# EAGLE schematic PS-001 (EAGLE 9.6.0)

## Sheet 1 of 4
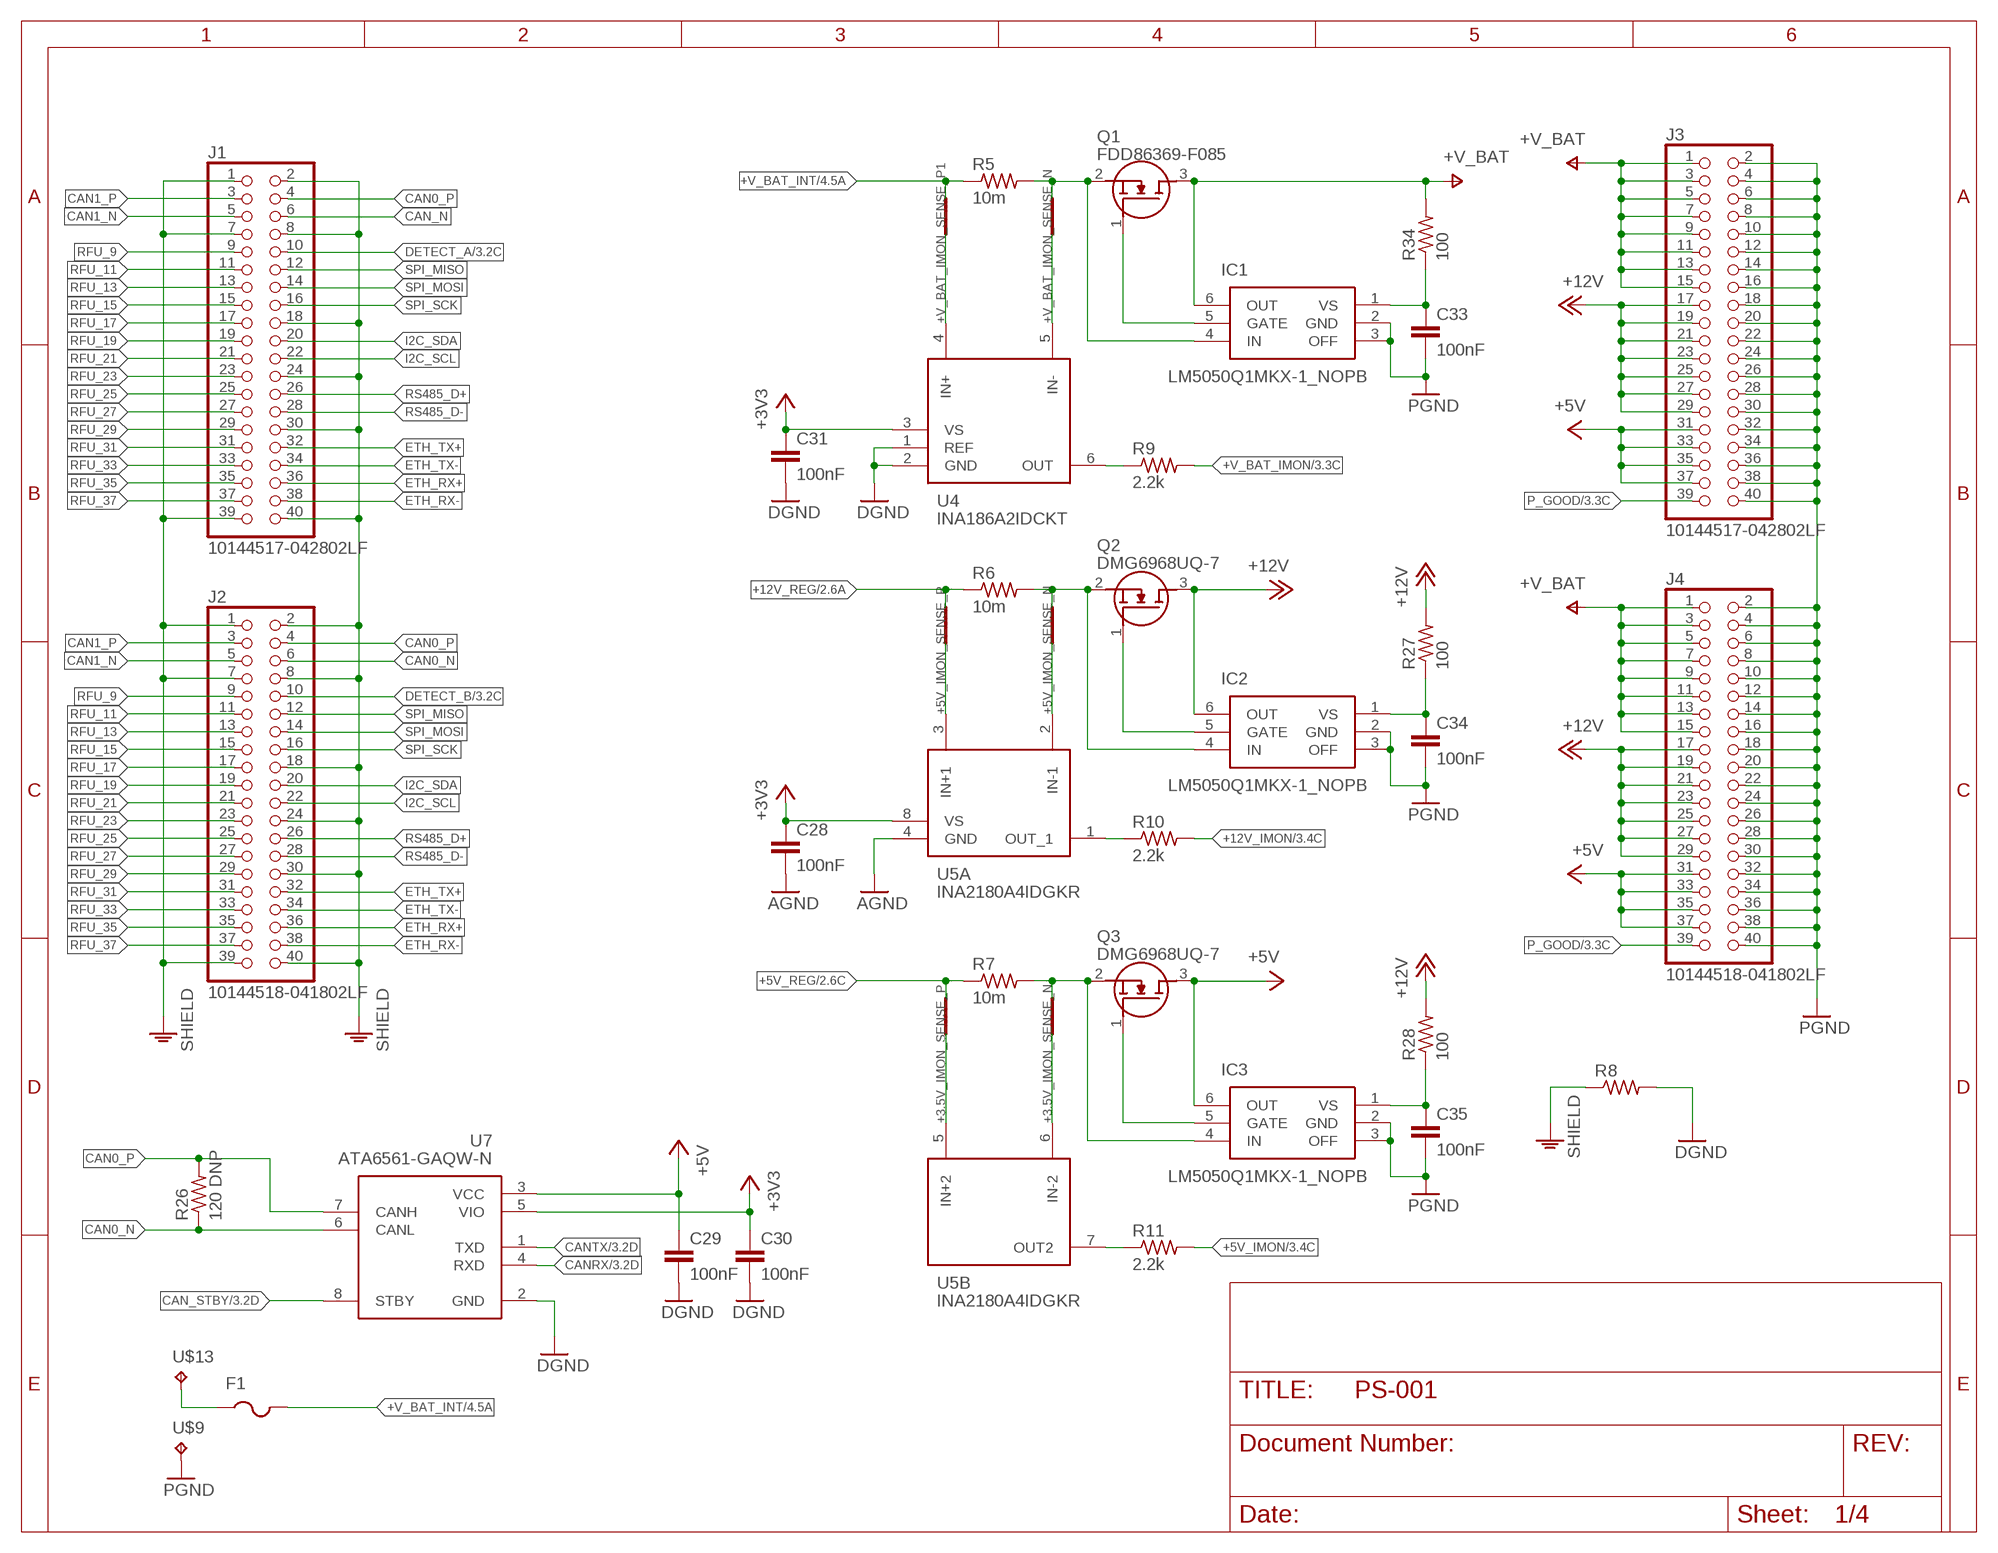
[diagram p0: schematic, sheet 1]

### Parts
C28  100nF  C-EUC0402  [C0402]
C29  100nF  C-EUC0402  [C0402]
C30  100nF  C-EUC0402  [C0402]
C31  100nF  C-EUC0402  [C0402]
C33  100nF  C-EUC0402  [C0402]
C34  100nF  C-EUC0402  [C0402]
C35  100nF  C-EUC0402  [C0402]
F1  PTCFUSE-1206  [R1206]
IC1  LM5050Q1MKX-1_NOPB  [SOT95P280X110-6N]
IC2  LM5050Q1MKX-1_NOPB  [SOT95P280X110-6N]
IC3  LM5050Q1MKX-1_NOPB  [SOT95P280X110-6N]
J1  10144517-042802LF  [10144517-042802LF]
J2  10144518-041802LF  [10144518-041802LF]
J3  10144517-042802LF  [10144517-042802LF]
J4  10144518-041802LF  [10144518-041802LF]
Q1  FDD86369-F085  [DPAK3-CASE-369AS]
Q2  DMG6968UQ-7  [SOT96P240X100-3N]
Q3  DMG6968UQ-7  [SOT96P240X100-3N]
R5  10m  R-US_R0603  [R0603]
R6  10m  R-US_R0603  [R0603]
R7  10m  R-US_R0603  [R0603]
R8  R-US_R0402  [R0402]
R9  2.2k  R-US_R0402  [R0402]
R10  2.2k  R-US_R0402  [R0402]
R11  2.2k  R-US_R0402  [R0402]
R26  120 DNP  R-US_R0402  [R0402]
R27  100  R-US_R0402  [R0402]
R28  100  R-US_R0402  [R0402]
R34  100  R-US_R0402  [R0402]
SH1  SHORTT8  [SHORT_TOP-8]
SH2  SHORTT8  [SHORT_TOP-8]
SH3  SHORTT8  [SHORT_TOP-8]
SH4  SHORTT8  [SHORT_TOP-8]
SH5  SHORTT8  [SHORT_TOP-8]
SH6  SHORTT8  [SHORT_TOP-8]
U4  INA186A2IDCKT  [SOT65P210X110-6N]
U5  INA2180A4IDGKR  INA2180A2IDGKR  [SOP65P490X110-8N]
U7  ATA6561-GAQW-N  [SOIC127P600X175-8N]
U$9  WIRE-PAD  [12AWG-STRANDED]
U$13  WIRE-PAD  [12AWG-STRANDED]

### Nets
+3.5V_IMON_SENSE_N: SH2.1 U5.6(B:IN-2)
+3.5V_IMON_SENSE_P: SH1.1 U5.5(B:IN+2)
+3V3: C28.1 C30.1 C31.1 U4.3(VS) U5.8(A:VS) U7.5(VIO) ; also sheet 2,3,4
+5V: C29.1 IC3.6(OUT) J3.31 J3.33 J3.35 J3.37 J4.31 J4.33 J4.35 J4.37 Q3.3(D) U7.3(VCC) ; also sheet 2,4
+5V_IMON: R11.2 ; also sheet 3
+5V_IMON_SENSE_N: SH4.1 U5.2(A:IN-1)
+5V_IMON_SENSE_P: SH3.1 U5.3(A:IN+1)
+5V_REG: R7.1 SH1.2 ; also sheet 2,4
+12V: IC2.6(OUT) J3.17 J3.19 J3.21 J3.23 J3.25 J3.27 J3.29 J4.17 J4.19 J4.21 J4.23 J4.25 J4.27 J4.29 Q2.3(D) R27.2 R28.2 ; also sheet 4
+12V_IMON: R10.2 ; also sheet 3
+12V_REG: R6.1 SH3.2 ; also sheet 2,4
+V_BAT: IC1.6(OUT) J3.1 J3.3 J3.5 J3.7 J3.9 J3.11 J3.13 J3.15 J4.1 J4.3 J4.5 J4.7 J4.9 J4.11 J4.13 J4.15 Q1.3(D) R34.2 ; also sheet 2,4
+V_BAT_IMON: R9.2 ; also sheet 3
+V_BAT_IMON_SENSE_N: SH6.1 U4.5(IN-)
+V_BAT_IMON_SENSE_P1: SH5.1 U4.4(IN+)
+V_BAT_INT: F1.2 R5.1 SH5.2 ; also sheet 4
AGND: C28.2 U5.4(A:GND)
CAN0_N: J2.6 R26.1 U7.6(CANL)
CAN0_P: J1.4 J2.4 R26.2 U7.7(CANH)
CAN1_N: J1.5 J2.5
CAN1_P: J1.3 J2.3
CAN_N: J1.6
CAN_STBY: U7.8(STBY) ; also sheet 3
CANRX: U7.4(RXD) ; also sheet 3
CANTX: U7.1(TXD) ; also sheet 3
DETECT_A: J1.10 ; also sheet 3
DETECT_B: J2.10 ; also sheet 3
DGND: C29.2 C30.2 C31.2 R8.2 U4.1(REF) U4.2(GND) U7.2(GND) ; also sheet 2,3,4
ETH_RX+: J1.36 J2.36
ETH_RX-: J1.38 J2.38
ETH_TX+: J1.32 J2.32
ETH_TX-: J1.34 J2.34
I2C_SCL: J1.22 J2.22
I2C_SDA: J1.20 J2.20
N$11: IC2.4(IN) Q2.2(S) R6.2 SH4.2
N$12: IC3.4(IN) Q3.2(S) R7.2 SH2.2
N$13: IC1.5(GATE) Q1.1(G)
N$14: C33.1 IC1.1(VS) R34.1
N$16: F1.1 U$13.P$1(TP)
N$17: R9.1 U4.6(OUT)
N$18: R10.1 U5.1(A:OUT_1)
N$19: IC1.4(IN) Q1.2(S) R5.2 SH6.2
N$20: IC2.5(GATE) Q2.1(G)
N$21: R11.1 U5.7(B:OUT2)
N$22: C34.1 IC2.1(VS) R27.1
N$25: IC3.5(GATE) Q3.1(G)
N$26: C35.1 IC3.1(VS) R28.1
P_GOOD: J3.39 J4.39 ; also sheet 3
PGND: C33.2 C34.2 C35.2 IC1.2(GND) IC1.3(OFF) IC2.2(GND) IC2.3(OFF) IC3.2(GND) IC3.3(OFF) J3.2 J3.4 J3.6 J3.8 J3.10 J3.12 J3.14 J3.16 J3.18 J3.20 J3.22 J3.24 J3.26 J3.28 J3.30 J3.32 J3.34 J3.36 J3.38 J3.40 J4.2 J4.4 J4.6 J4.8 J4.10 J4.12 J4.14 J4.16 J4.18 J4.20 J4.22 J4.24 J4.26 J4.28 J4.30 J4.32 J4.34 J4.36 J4.38 J4.40 U$9.P$1(TP) ; also sheet 2,3
RFU_9: J1.9 J2.9
RFU_11: J1.11 J2.11
RFU_13: J1.13 J2.13
RFU_15: J1.15 J2.15
RFU_17: J1.17 J2.17
RFU_19: J1.19 J2.19
RFU_21: J1.21 J2.21
RFU_23: J1.23 J2.23
RFU_25: J1.25 J2.25
RFU_27: J1.27 J2.27
RFU_29: J1.29 J2.29
RFU_31: J1.31 J2.31
RFU_33: J1.33 J2.33
RFU_35: J1.35 J2.35
RFU_37: J1.37 J2.37
RS485_D+: J1.26 J2.26
RS485_D-: J1.28 J2.28
SHIELD: J1.1 J1.2 J1.7 J1.8 J1.18 J1.24 J1.30 J1.39 J1.40 J2.1 J2.2 J2.7 J2.8 J2.18 J2.24 J2.30 J2.39 J2.40 R8.1
SPI_MISO: J1.12 J2.12
SPI_MOSI: J1.14 J2.14
SPI_SCK: J1.16 J2.16

## Sheet 2 of 4
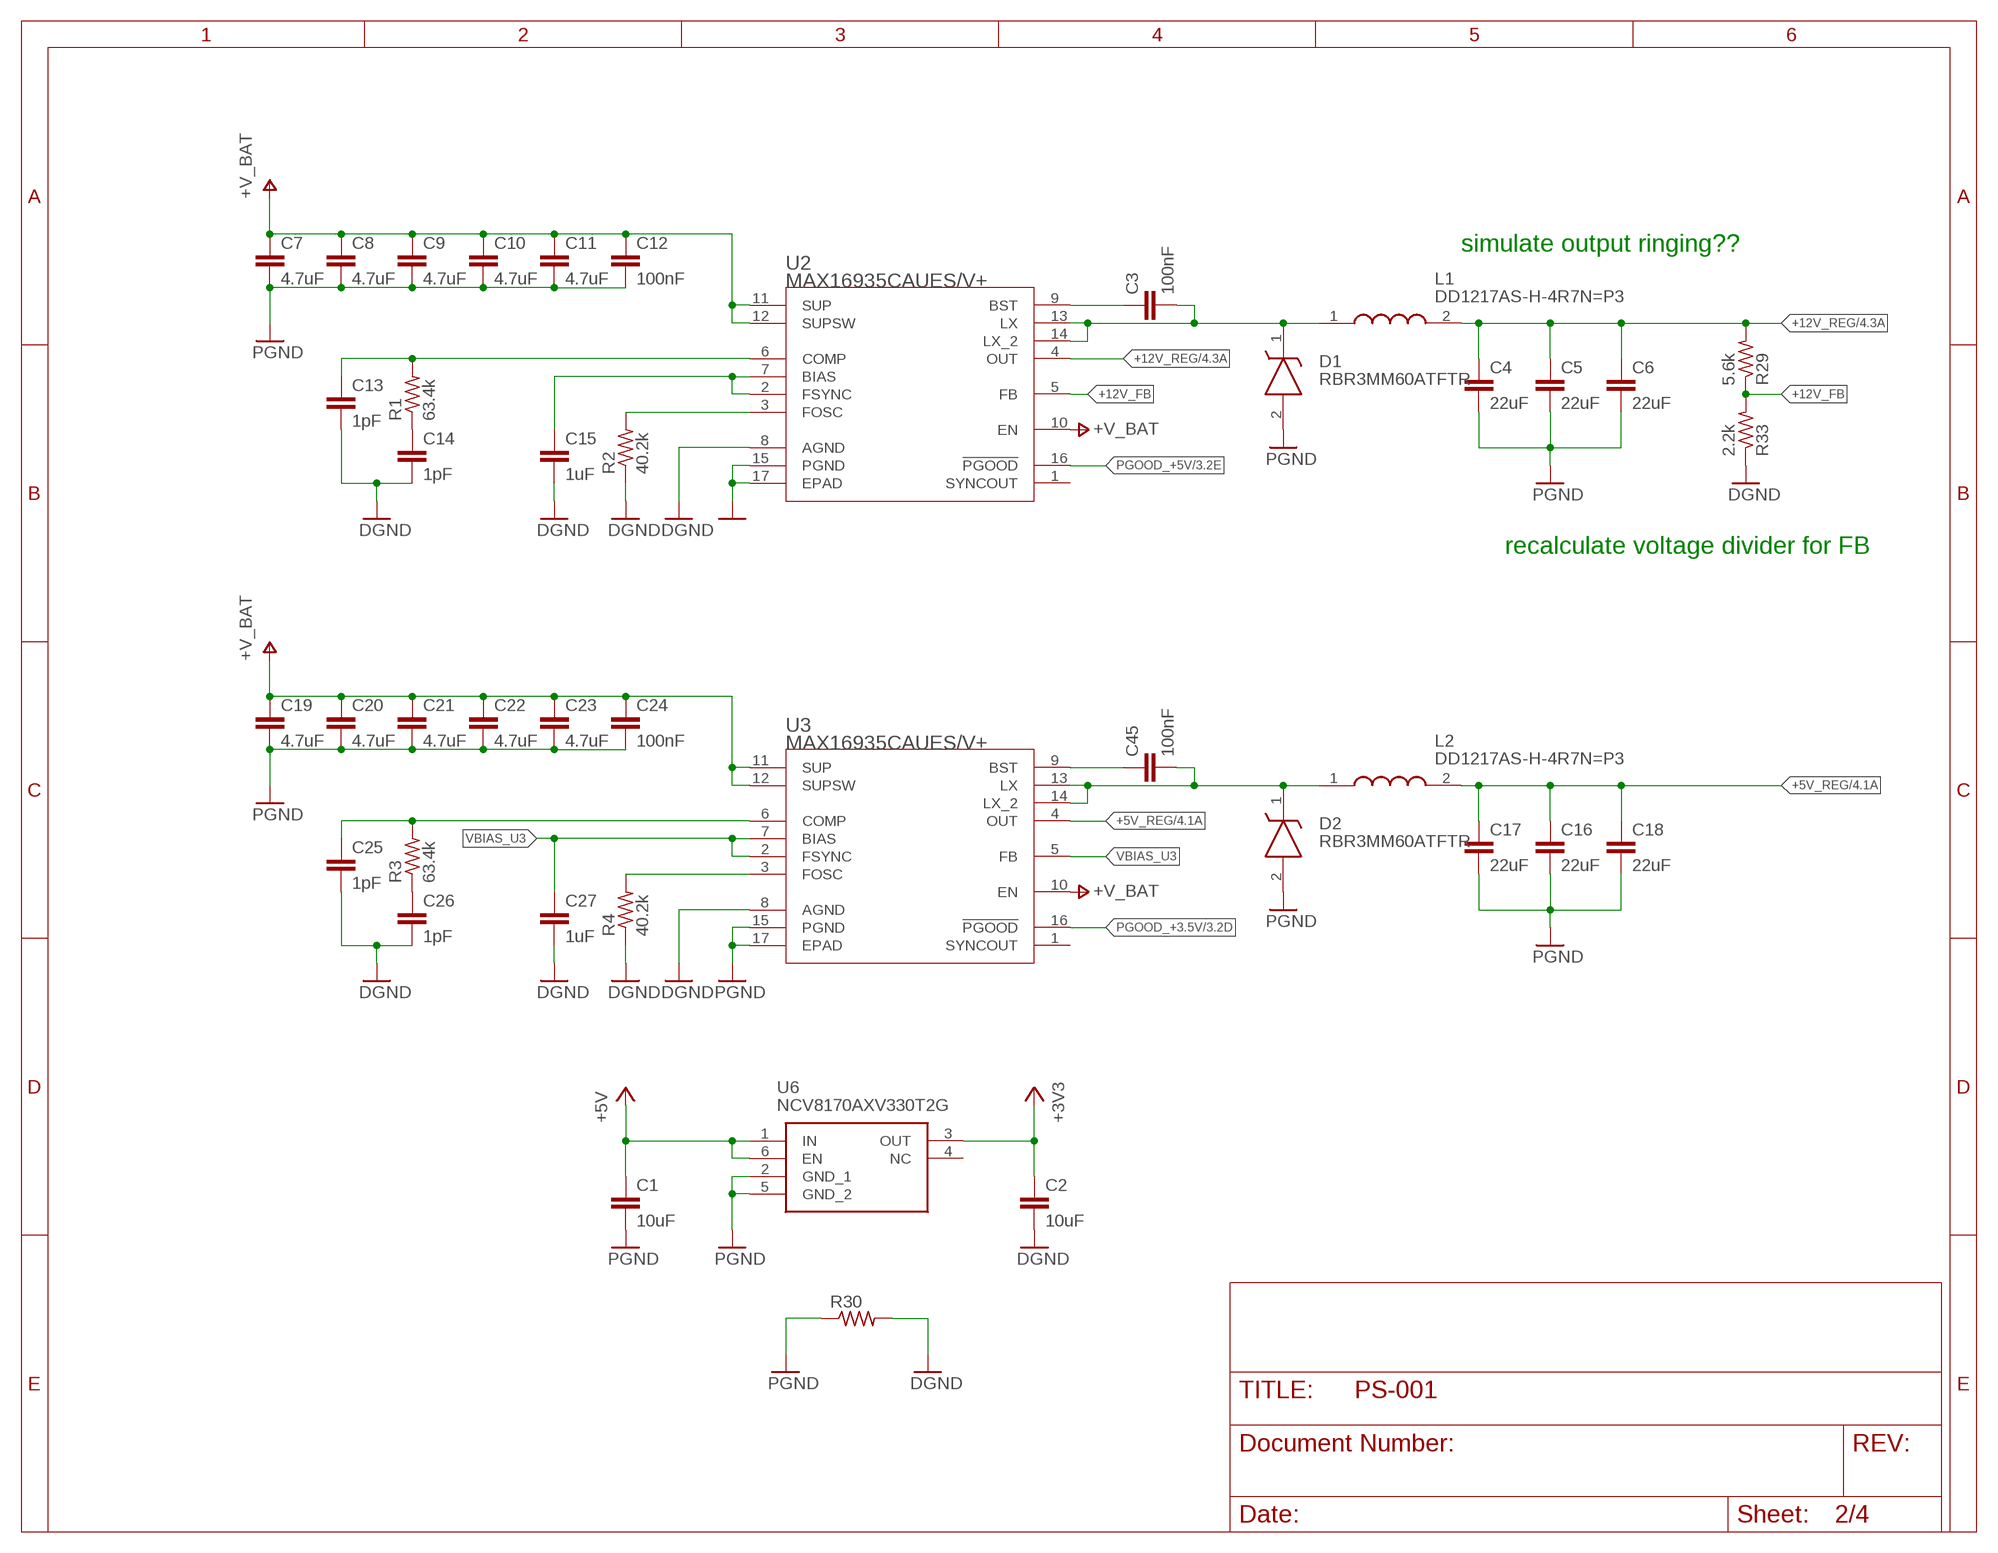
[diagram p1: schematic, sheet 2]

### Parts
C1  10uF  C-EUC0805  [C0805]
C2  10uF  C-EUC0805  [C0805]
C3  100nF  C-EUC0603  [C0603]
C4  22uF  C-EUC1206  [C1206]
C5  22uF  C-EUC1206  [C1206]
C6  22uF  C-EUC1206  [C1206]
C7  4.7uF  C-EUC0805  [C0805]
C8  4.7uF  C-EUC0805  [C0805]
C9  4.7uF  C-EUC0805  [C0805]
C10  4.7uF  C-EUC0805  [C0805]
C11  4.7uF  C-EUC0805  [C0805]
C12  100nF  C-EUC0603  [C0603]
C13  1pF  C-EUC0402  [C0402]
C14  1pF  C-EUC0402  [C0402]
C15  1uF  C-EUC0402  [C0402]
C16  22uF  C-EUC1206  [C1206]
C17  22uF  C-EUC1206  [C1206]
C18  22uF  C-EUC1206  [C1206]
C19  4.7uF  C-EUC0805  [C0805]
C20  4.7uF  C-EUC0805  [C0805]
C21  4.7uF  C-EUC0805  [C0805]
C22  4.7uF  C-EUC0805  [C0805]
C23  4.7uF  C-EUC0805  [C0805]
C24  100nF  C-EUC0603  [C0603]
C25  1pF  C-EUC0402  [C0402]
C26  1pF  C-EUC0402  [C0402]
C27  1uF  C-EUC0402  [C0402]
C45  100nF  C-EUC0603  [C0603]
D1  RBR3MM60ATFTR  [PMDU]
D2  RBR3MM60ATFTR  [PMDU]
L1  DD1217AS-H-4R7N=P3  [INDPM8282X450N]
L2  DD1217AS-H-4R7N=P3  [INDPM8282X450N]
R1  63.4k  R-US_R0603  [R0603]
R2  40.2k  R-US_R0603  [R0603]
R3  63.4k  R-US_R0603  [R0603]
R4  40.2k  R-US_R0603  [R0603]
R29  5.6k  R-US_R0402  [R0402]
R30  R-US_R0402  [R0402]
R33  2.2k  R-US_R0402  [R0402]
U2  MAX16935CAUES/V+  [21-0108G_U16E-3]
U3  MAX16935CAUES/V+  [21-0108G_U16E-3]
U6  NCV8170AXV330T2G  [SOTFL50P160X60-6N]

### Nets
+3V3: C2.1 U6.3(OUT) ; also sheet 1,3,4
+5V: C1.1 U6.1(IN) U6.6(EN) ; also sheet 1,4
+5V_REG: C16.1 C17.1 C18.1 L2.2 U3.4(OUT) ; also sheet 1,4
+12V_FB: R29.1 R33.2 U2.5(FB)
+12V_REG: C4.1 C5.1 C6.1 L1.2 R29.2 U2.4(OUT) ; also sheet 1,4
+V_BAT: C7.1 C8.1 C9.1 C10.1 C11.1 C12.1 C19.1 C20.1 C21.1 C22.1 C23.1 C24.1 U2.10(EN) U2.11(SUP) U2.12(SUPSW) U3.10(EN) U3.11(SUP) U3.12(SUPSW) ; also sheet 1,4
DGND: C2.2 C13.2 C14.2 C15.2 C25.2 C26.2 C27.2 R2.1 R4.1 R30.2 R33.1 U2.8(AGND) U3.8(AGND) ; also sheet 1,3,4
N$1: R2.2 U2.3(FOSC)
N$2: C13.1 R1.2 U2.6(COMP)
N$3: C3.1 U2.9(BST)
N$4: C3.2 D1.1(K) L1.1 U2.13(LX) U2.14(LX_2)
N$5: C45.2 D2.1(K) L2.1 U3.13(LX) U3.14(LX_2)
N$6: C45.1 U3.9(BST)
N$7: C25.1 R3.2 U3.6(COMP)
N$8: C14.1 R1.1
N$9: C26.1 R3.1
N$10: R4.2 U3.3(FOSC)
PGND: C1.2 C4.2 C5.2 C6.2 C7.2 C8.2 C9.2 C10.2 C11.2 C12.2 C16.2 C17.2 C18.2 C19.2 C20.2 C21.2 C22.2 C23.2 C24.2 D1.2(A) D2.2(A) R30.1 U2.15(PGND) U2.17(EPAD) U3.15(PGND) U3.17(EPAD) U6.2(GND_1) U6.5(GND_2) ; also sheet 1,3
PGOOD_+3.5V: U3.16(!PGOOD) ; also sheet 3
PGOOD_+5V: U2.16(!PGOOD) ; also sheet 3
VBIAS_U2: C15.1 U2.2(FSYNC) U2.7(BIAS)
VBIAS_U3: C27.1 U3.2(FSYNC) U3.5(FB) U3.7(BIAS)
Unconnected: U2.1(SYNCOUT) U3.1(SYNCOUT) U6.4(NC)

### Notes on the sheet
- simulate output ringing??
- recalculate voltage divider for FB

## Sheet 3 of 4
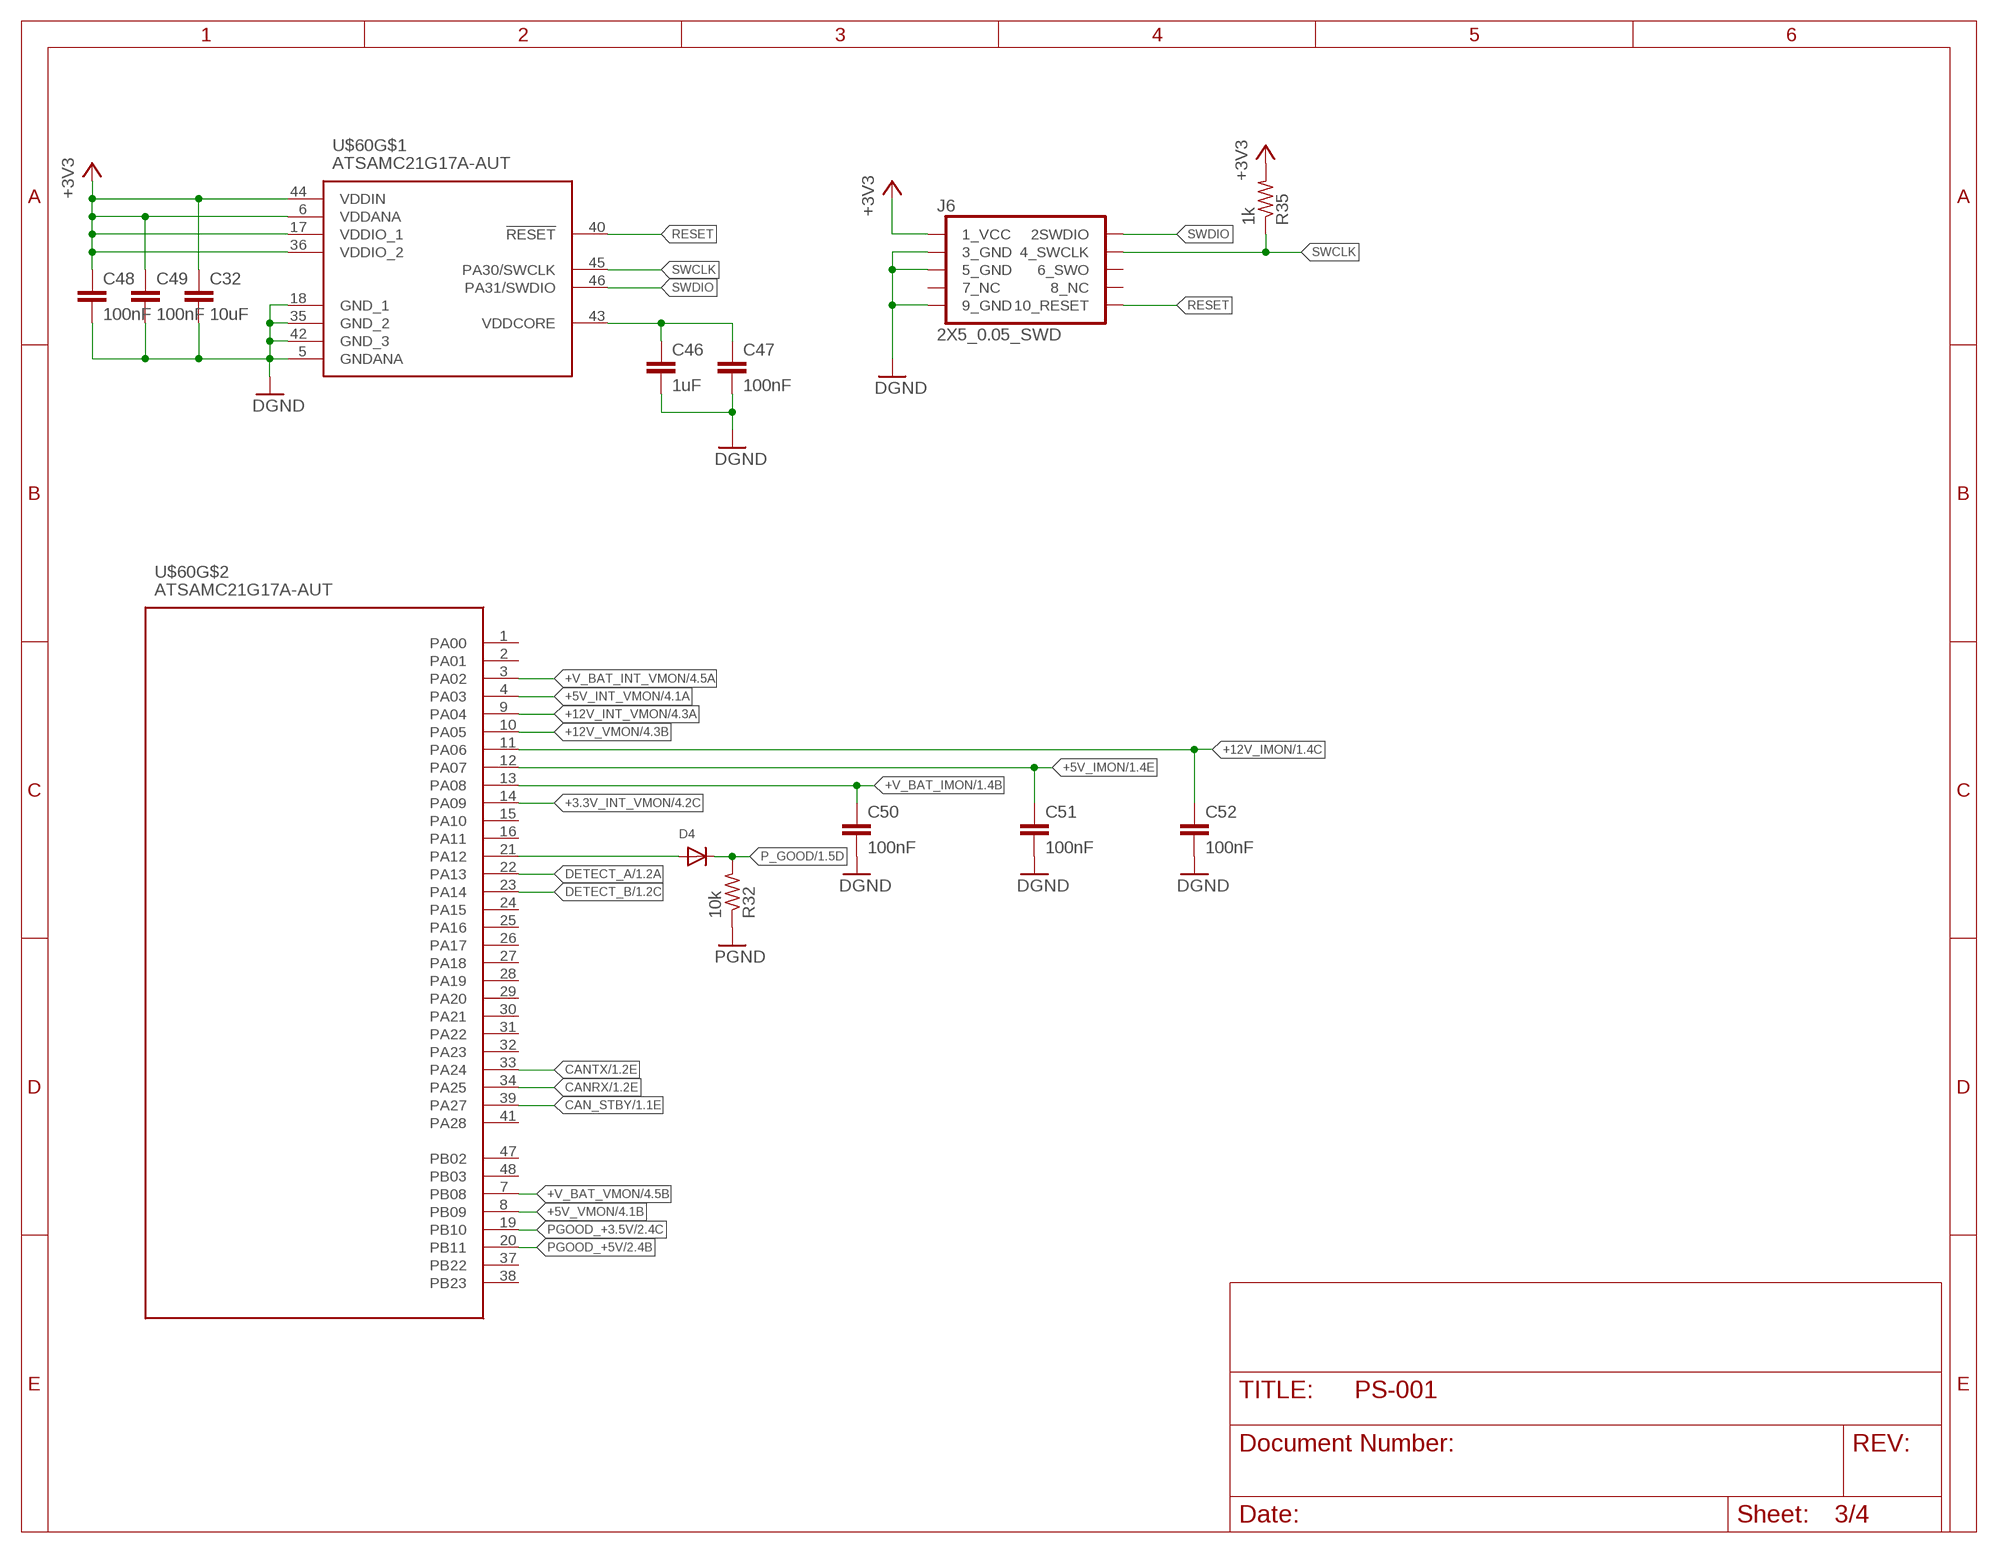
[diagram p2: schematic, sheet 3]

### Parts
C32  10uF  C-EUC0805  [C0805]
C46  1uF  C-EUC0805  [C0805]
C47  100nF  C-EUC0805  [C0805]
C48  100nF  C-EUC0402  [C0402]
C49  100nF  C-EUC0402  [C0402]
C50  100nF  C-EUC0402  [C0402]
C51  100nF  C-EUC0402  [C0402]
C52  100nF  C-EUC0402  [C0402]
D4  DIODESOD-123  [SOD-123]
J6  2X5_0.05_SWD  [2X5_RIGHT]
R32  10k  R-US_R0402  [R0402]
R35  1k  R-US_R0402  [R0402]
U$60  ATSAMC21G17A-AUT  [QFP50P900X900X120-48N]

### Nets
+3.3V_INT_VMON: U$60.14(PA09) ; also sheet 4
+3V3: C32.1 C48.1 C49.1 J6.1(1_VCC) R35.2 U$60.6(VDDANA) U$60.17(VDDIO_1) U$60.36(VDDIO_2) U$60.44(VDDIN) ; also sheet 1,2,4
+5V_IMON: C51.1 U$60.12(PA07) ; also sheet 1
+5V_INT_VMON: U$60.4(PA03) ; also sheet 4
+5V_VMON: U$60.8(PB09) ; also sheet 4
+12V_IMON: C52.1 U$60.11(PA06) ; also sheet 1
+12V_INT_VMON: U$60.9(PA04) ; also sheet 4
+12V_VMON: U$60.10(PA05) ; also sheet 4
+V_BAT_IMON: C50.1 U$60.13(PA08) ; also sheet 1
+V_BAT_INT_VMON: U$60.3(PA02) ; also sheet 4
+V_BAT_VMON: U$60.7(PB08) ; also sheet 4
CAN_STBY: U$60.39(PA27) ; also sheet 1
CANRX: U$60.34(PA25) ; also sheet 1
CANTX: U$60.33(PA24) ; also sheet 1
DETECT_A: U$60.22(PA13) ; also sheet 1
DETECT_B: U$60.23(PA14) ; also sheet 1
DGND: C32.2 C46.2 C47.2 C48.2 C49.2 C50.2 C51.2 C52.2 J6.3(3_GND) J6.5(5_GND) J6.9(9_GND) U$60.5(GNDANA) U$60.18(GND_1) U$60.35(GND_2) U$60.42(GND_3) ; also sheet 1,2,4
N$29: C46.1 C47.1 U$60.43(VDDCORE)
N$30: D4.A U$60.21(PA12)
P_GOOD: D4.C R32.2 ; also sheet 1
PGND: R32.1 ; also sheet 1,2
PGOOD_+3.5V: U$60.19(PB10) ; also sheet 2
PGOOD_+5V: U$60.20(PB11) ; also sheet 2
RESET: J6.10(10_RESET) U$60.40(!RESET)
SWCLK: J6.4(4_SWCLK) R35.1 U$60.45(PA30/SWCLK)
SWDIO: J6.2(2SWDIO) U$60.46(PA31/SWDIO)
Unconnected: J6.6(6_SWO) J6.7(7_NC) J6.8(8_NC) U$60.1(PA00) U$60.2(PA01) U$60.15(PA10) U$60.16(PA11) U$60.24(PA15) U$60.25(PA16) U$60.26(PA17) U$60.27(PA18) U$60.28(PA19) U$60.29(PA20) U$60.30(PA21) U$60.31(PA22) U$60.32(PA23) U$60.37(PB22) U$60.38(PB23) U$60.41(PA28) U$60.47(PB02) U$60.48(PB03)

## Sheet 4 of 4
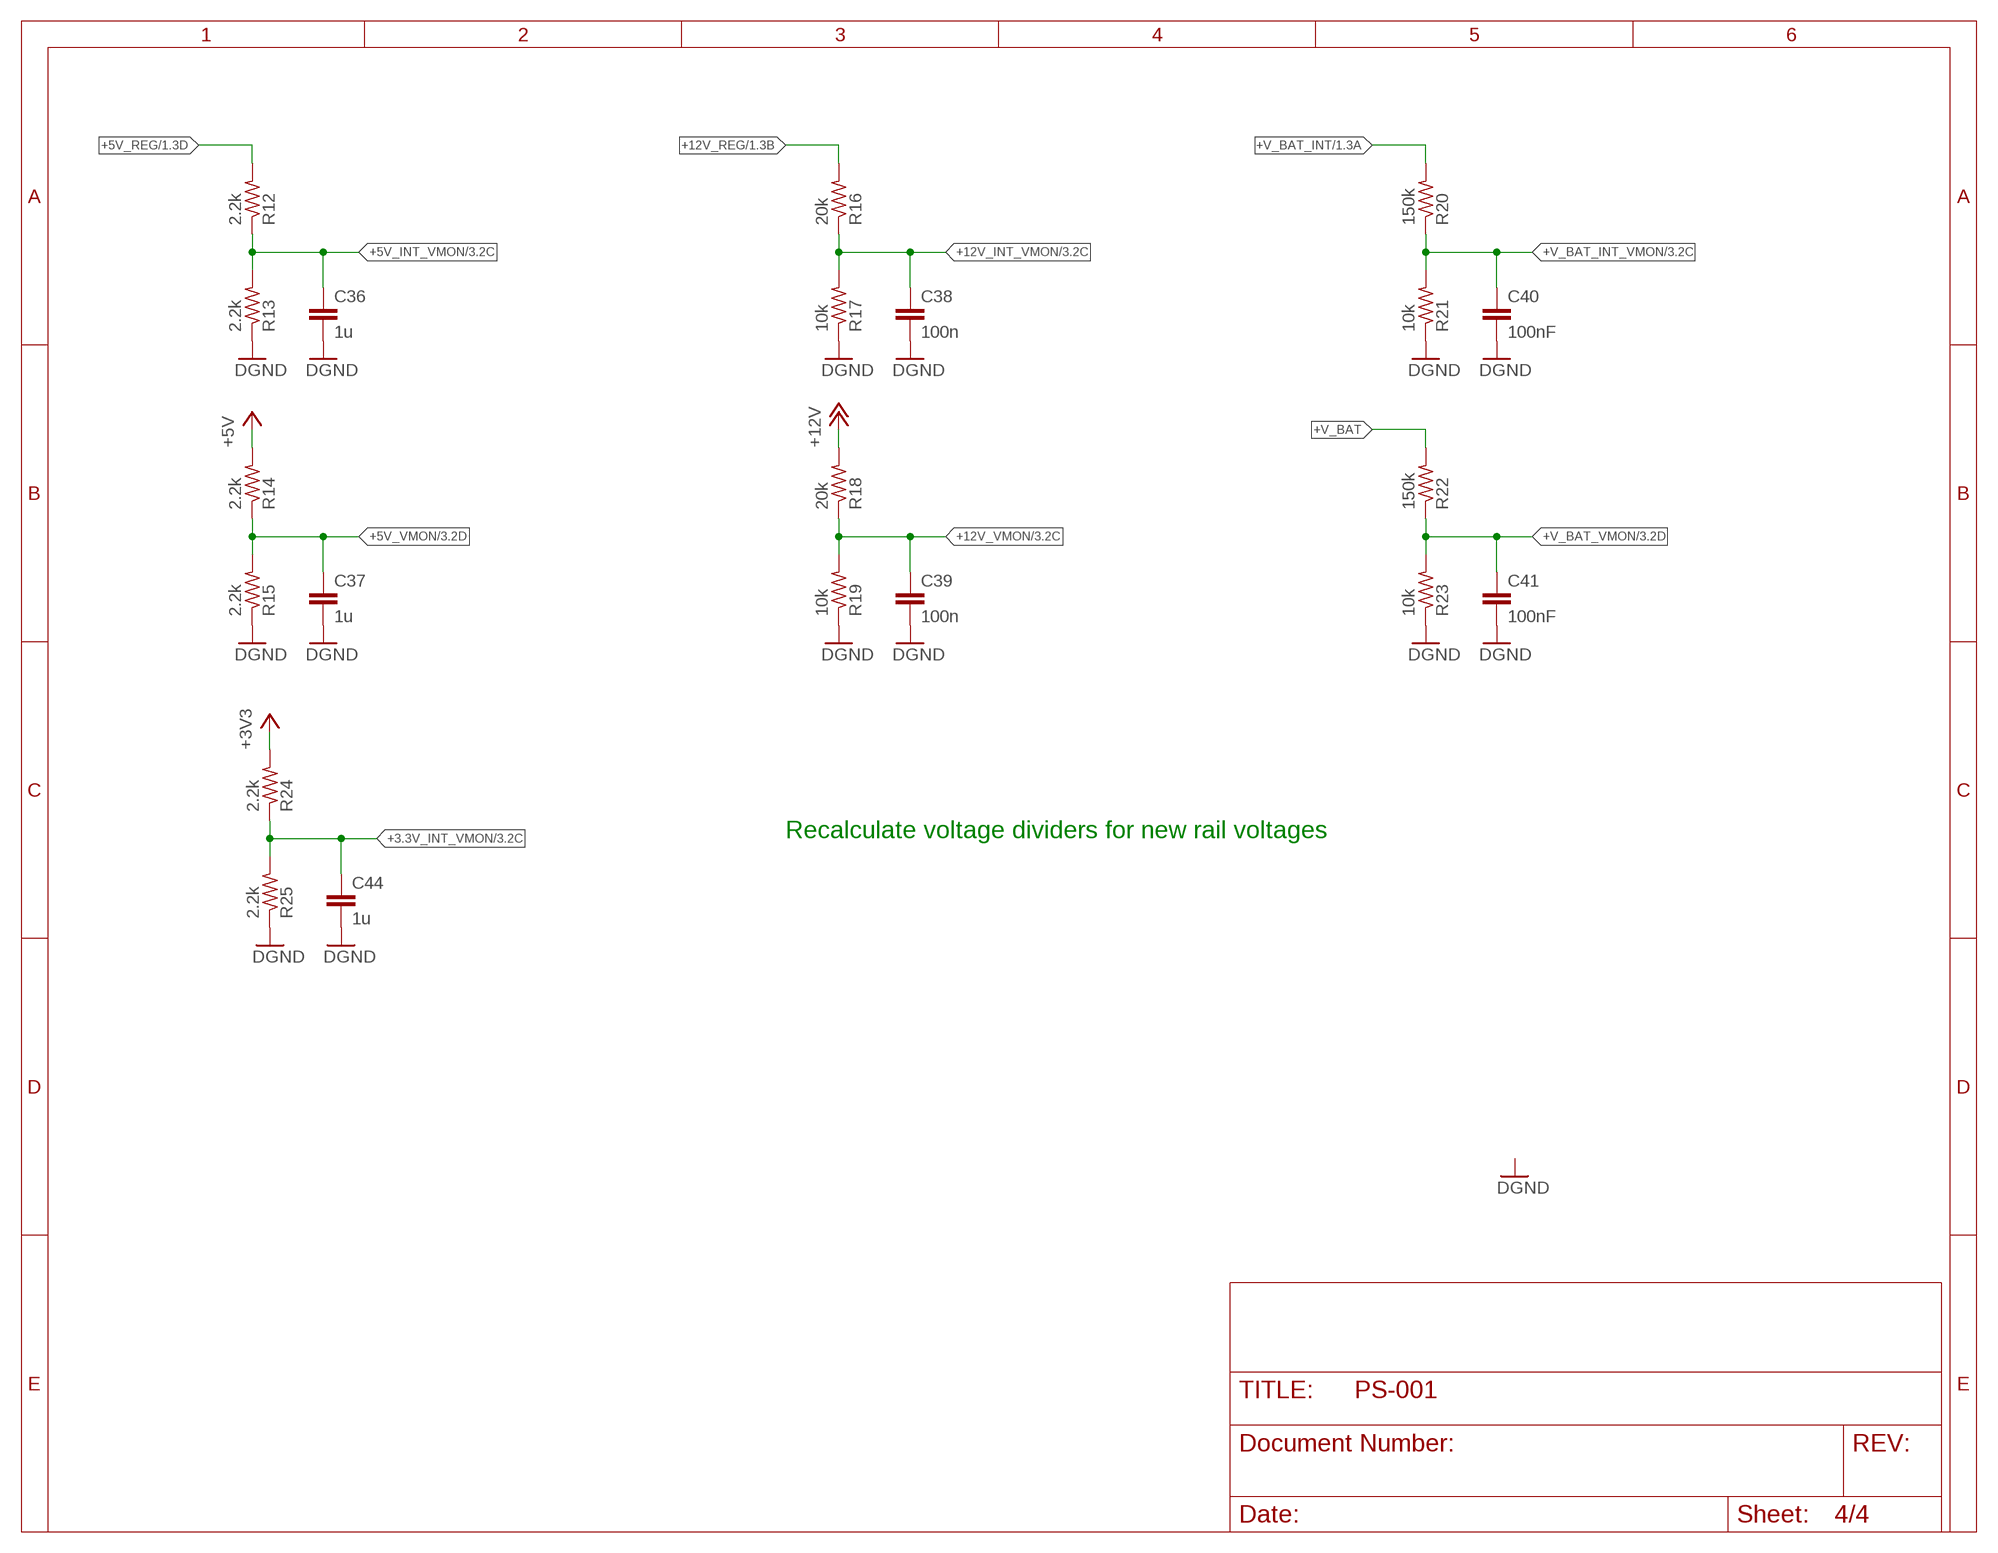
[diagram p3: schematic, sheet 4]

### Parts
C36  1u  C-EUC0402  [C0402]
C37  1u  C-EUC0402  [C0402]
C38  100n  C-EUC0402  [C0402]
C39  100n  C-EUC0402  [C0402]
C40  100nF  C-EUC0402  [C0402]
C41  100nF  C-EUC0402  [C0402]
C44  1u  C-EUC0402  [C0402]
R12  2.2k  R-US_R0402  [R0402]
R13  2.2k  R-US_R0402  [R0402]
R14  2.2k  R-US_R0402  [R0402]
R15  2.2k  R-US_R0402  [R0402]
R16  20k  R-US_R0402  [R0402]
R17  10k  R-US_R0402  [R0402]
R18  20k  R-US_R0402  [R0402]
R19  10k  R-US_R0402  [R0402]
R20  150k  R-US_R0402  [R0402]
R21  10k  R-US_R0402  [R0402]
R22  150k  R-US_R0402  [R0402]
R23  10k  R-US_R0402  [R0402]
R24  2.2k  R-US_R0402  [R0402]
R25  2.2k  R-US_R0402  [R0402]

### Nets
+3.3V_INT_VMON: C44.1 R24.1 R25.2 ; also sheet 3
+3V3: R24.2 ; also sheet 1,2,3
+5V: R14.2 ; also sheet 1,2
+5V_INT_VMON: C36.1 R12.1 R13.2 ; also sheet 3
+5V_REG: R12.2 ; also sheet 1,2
+5V_VMON: C37.1 R14.1 R15.2 ; also sheet 3
+12V: R18.2 ; also sheet 1
+12V_INT_VMON: C38.1 R16.1 R17.2 ; also sheet 3
+12V_REG: R16.2 ; also sheet 1,2
+12V_VMON: C39.1 R18.1 R19.2 ; also sheet 3
+V_BAT: R22.2 ; also sheet 1,2
+V_BAT_INT: R20.2 ; also sheet 1
+V_BAT_INT_VMON: C40.1 R20.1 R21.2 ; also sheet 3
+V_BAT_VMON: C41.1 R22.1 R23.2 ; also sheet 3
DGND: C36.2 C37.2 C38.2 C39.2 C40.2 C41.2 C44.2 R13.1 R15.1 R17.1 R19.1 R21.1 R23.1 R25.1 ; also sheet 1,2,3

### Notes on the sheet
- Recalculate voltage dividers for new rail voltages

## Library data of the parts
C1-C41 C44-C52 = rcl:C-EU: CAPACITOR, European symbol; SPICEPREFIX: C
D1 D2 = SamacSys_Parts:RBR3MM60ATFTR: ROHM - RBR3MM60ATFTR - SCHOTTKY RECTIFIER, AEC-Q101, 3A, 60V Source: Datasheet <https://componentsearchengine.com/Datasheets/1/RBR3MM60ATFTR.pdf>; DESCRIPTION: ROHM - RBR3MM60ATFTR - SCHOTTKY RECTIFIER, AEC-Q101, 3A, 60V; HEIGHT: mm; MANUFACTURER_NAME: ROHM Semiconductor; MANUFACTURER_PART_NUMBER: RBR3MM60ATFTR; MOUSER_PART_NUMBER: 755-RBR3MM60ATFTR; MOUSER_PRICE-STOCK: https://www.mouser.com/Search/Refine.aspx?Keyword=755-RBR3MM60ATFTR
D4 = adafruit:DIODE: Diode SMADIODE - SMA Surface Mount Package 20V 1A Schottky Diode Digikey: 641-1014-6-ND DO-1N4148 - Through Hole Small Current Diode SOD-123 20V 1 A (.5mV Vf) Schottky Diode - Digikey: MBRX120TPMSCT-ND SOD-323 10V 570mA (.38mV Vf, 3ns) Schottky Diode - Digikey: ZLLS410CT-ND SOD-523 30V 30mA Schottky Diode (RB751S-40TE61) - Digikey: RB751S-40TE61CT-ND SOT23-R/W - SOT23 Package (R = Solder Paste/Reflow Ovens, W = Hand-Soldering) BAT54Film 40V 300mA - Digikey: 497-7162-1-ND
F1 = adafruit:PTCFUSE: PTC fuses, resettable thermistors
IC1-IC3 = SamacSys_Parts:LM5050Q1MKX-1_NOPB: OR Controller N-Channel Single-OUT Automotive 6-Pin TSOT-23 T/R Source: Datasheet <http://www.ti.com/lit/gpn/lm5050-1-q1>; DESCRIPTION: OR Controller N-Channel Single-OUT Automotive 6-Pin TSOT-23 T/R; HEIGHT: 1.1mm; MANUFACTURER_NAME: Texas Instruments; MANUFACTURER_PART_NUMBER: LM5050Q1MKX-1/NOPB; MOUSER_PART_NUMBER: 595-LM5050Q1MKX1NOPB; MOUSER_PRICE-STOCK: https://www.mouser.com/Search/Refine.aspx?Keyword=595-LM5050Q1MKX1NOPB
J1 J3 = BergStak:10144517-04
J2 J4 = BergStak:10144518-04
J6 = Headers:2X5_0.05_SWD
L1 L2 = SamacSys Managed:DD1217AS-H-4R7N=P3: MURATA - DD1217AS-H-4R7N=P3 - Power Inductor (SMD), 4.7 ?H, 6.3 A, Wirewound, 6.7 A, DEM8045C_DD Series, 8mm x 8mm x 4.5mm Source: Datasheet <https://mouser.componentsearchengine.com/Datasheets/2/DD1217AS-H-4R7N=P3.pdf>; DESCRIPTION: MURATA - DD1217AS-H-4R7N=P3 - Power Inductor (SMD), 4.7 ?H, 6.3 A, Wirewound, 6.7 A, DEM8045C_DD Series, 8mm x 8mm x 4.5mm; HEIGHT: 4.5mm; MANUFACTURER_NAME: Murata Electronics; MANUFACTURER_PART_NUMBER: DD1217AS-H-4R7N=P3
Q1 = SamacSys_Parts:FDD86369-F085: MOSFET 80V 90A Dual DPAK N-Chnl PowerTrench Source: Datasheet <https://componentsearchengine.com/Datasheets/1/FDD86369-F085.pdf>; DESCRIPTION: MOSFET 80V 90A Dual DPAK N-Chnl PowerTrench; HEIGHT: mm; MANUFACTURER_NAME: ON Semiconductor; MANUFACTURER_PART_NUMBER: FDD86369-F085; MOUSER_PART_NUMBER: 512-FDD86369_F085; MOUSER_PRICE-STOCK: https://www.mouser.com/Search/Refine.aspx?Keyword=512-FDD86369_F085
Q2 Q3 = SamacSys_Parts:DMG6968UQ-7: Trans MOSFET N-CH 20V 6.5A Automotive 3-Pin SOT-23 T/R Source: Datasheet <https://componentsearchengine.com/Datasheets/1/DMG6968UQ-7.pdf>; DESCRIPTION: Trans MOSFET N-CH 20V 6.5A Automotive 3-Pin SOT-23 T/R; HEIGHT: 1mm; MANUFACTURER_NAME: Diodes Inc.; MANUFACTURER_PART_NUMBER: DMG6968UQ-7; MOUSER_PART_NUMBER: 621-DMG6968UQ-7; MOUSER_PRICE-STOCK: https://www.mouser.com/Search/Refine.aspx?Keyword=621-DMG6968UQ-7
R1-R30 R32-R35 = rcl:R-US_: RESISTOR, American symbol; SPICEPREFIX: R
SH1-SH6 = shorts:SHORT: Short between two nets
U2 U3 = MAX16935:MAX16935CAUES/V+; MANUFACTURER_PART_NUMBER: MAX16935CAUESV+; VENDOR: Maxim Integrated Products
U4 = SamacSys_Parts:INA186A2IDCKT: Current Sense Amplifiers Voltage output high-side measurement current shunt monitor 6-SC70 -40 to 125 Source: Datasheet <https://www.digikey.in/product-detail/en/texas-instruments/INA186A2IDCKT/296-INA186A2IDCKTTR-ND/10448318>; DESCRIPTION: Current Sense Amplifiers Voltage output high-side measurement current shunt monitor 6-SC70 -40 to 125; HEIGHT: 1.1mm; MANUFACTURER_NAME: Texas Instruments; MANUFACTURER_PART_NUMBER: INA186A2IDCKT; MOUSER_PART_NUMBER: 595-INA186A2IDCKT; MOUSER_PRICE-STOCK: https://www.mouser.com/Search/Refine.aspx?Keyword=595-INA186A2IDCKT
U5 = SamacSys_Parts:INA2180A2IDGKR: Current Sense Amplifiers Dual 26V, Low- or High-Side Voltage Output Current Sense Amplifier 8-VSSOP -40 to 125 Source: Datasheet <http://www.ti.com/lit/gpn/ina2180>; DESCRIPTION: Current Sense Amplifiers Dual 26V, Low- or High-Side Voltage Output Current Sense Amplifier 8-VSSOP -40 to 125; HEIGHT: 1.1mm; MANUFACTURER_NAME: Texas Instruments; MANUFACTURER_PART_NUMBER: INA2180A2IDGKR; MOUSER_PART_NUMBER: 595-INA2180A2IDGKR; MOUSER_PRICE-STOCK: https://www.mouser.com/Search/Refine.aspx?Keyword=595-INA2180A2IDGKR
U6 = SamacSys_Parts:NCV8170AXV330T2G: ON Semiconductor NCV8170AXV330T2G, LDO Voltage Regulator, 3.3 V +/-1%, 2.2 5.5 Vin, 6-Pin SOT-563 Source: Datasheet <https://componentsearchengine.com/Datasheets/1/NCV8170AXV330T2G.pdf>; DESCRIPTION: ON Semiconductor NCV8170AXV330T2G, LDO Voltage Regulator, 3.3 V +/-1%, 2.2 5.5 Vin, 6-Pin SOT-563; HEIGHT: 0.6mm; MANUFACTURER_NAME: ON Semiconductor; MANUFACTURER_PART_NUMBER: NCV8170AXV330T2G; MOUSER_PART_NUMBER: 863-NCV8170AXV330T2G; MOUSER_PRICE-STOCK: https://www.mouser.com/Search/Refine.aspx?Keyword=863-NCV8170AXV330T2G
U7 = SamacSys Managed:ATA6561-GAQW-N: MICROCHIP - ATA6561-GAQW-N - CAN TRANSCEIVER, 5MBPS, -40 TO 150DEG C Source: Datasheet <https://componentsearchengine.com/Datasheets/1/ATA6561-GAQW-N.pdf>; DESCRIPTION: MICROCHIP - ATA6561-GAQW-N - CAN TRANSCEIVER, 5MBPS, -40 TO 150DEG C; HEIGHT: 1.75mm; MANUFACTURER_NAME: Microchip; MANUFACTURER_PART_NUMBER: ATA6561-GAQW-N; MOUSER_PART_NUMBER: 579-ATA6561-GAQW-N; MOUSER_PRICE-STOCK: https://www.mouser.com/Search/Refine.aspx?Keyword=579-ATA6561-GAQW-N
U$9 U$13 = Wire Pads:WIRE-PAD
U$60 = ATSAM:ATSAMC21G17A-AUT: ARM Microcontrollers - MCU 48TQFP,85C TEMP, GREEN, 5V, 48MHZ, T&R Source: Datasheet <http://ww1.microchip.com/downloads/en/DeviceDoc/SAMC20_C21_%20Family_Data_%20Sheet_DS60001479D.pdf>